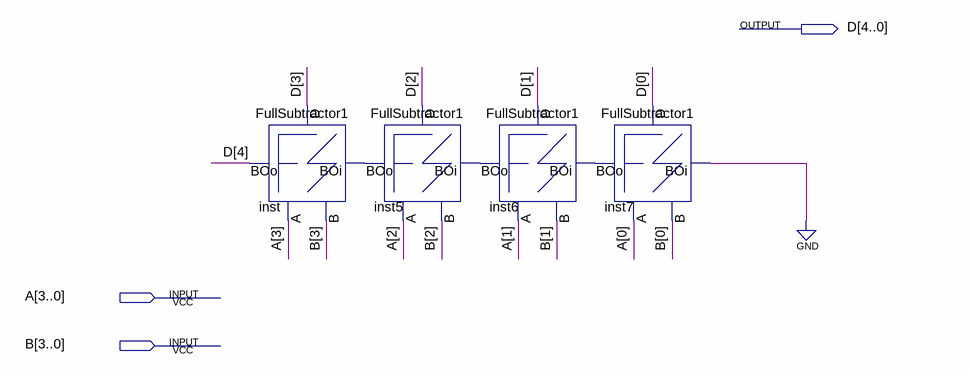
[diagram p0: schematic sheet]
// Quartus schematic FullSubtractor4.bdf as structural Verilog: 4 symbols, 3 pins
module FullSubtractor4 (
  input  [3:0] A,
  input  [3:0] B,
  output [4:0] D
);

  wire inst5_boo, inst6_boo, inst7_boo;

  FullSubtractor1 inst (.B(B[3]), .A(A[3]), .BOi(inst5_boo), .BOo(D[4]), .D(D[3]));
  FullSubtractor1 inst5 (.B(B[2]), .A(A[2]), .BOi(inst6_boo), .BOo(inst5_boo), .D(D[2]));
  FullSubtractor1 inst6 (.B(B[1]), .A(A[1]), .BOi(inst7_boo), .BOo(inst6_boo), .D(D[1]));
  FullSubtractor1 inst7 (.B(B[0]), .A(A[0]), .BOi(1'b0), .BOo(inst7_boo), .D(D[0]));
endmodule
